# Altium schematic sheet Power_Management.SchDoc
size A4; SheetNumber: 1; SheetTotal: 4
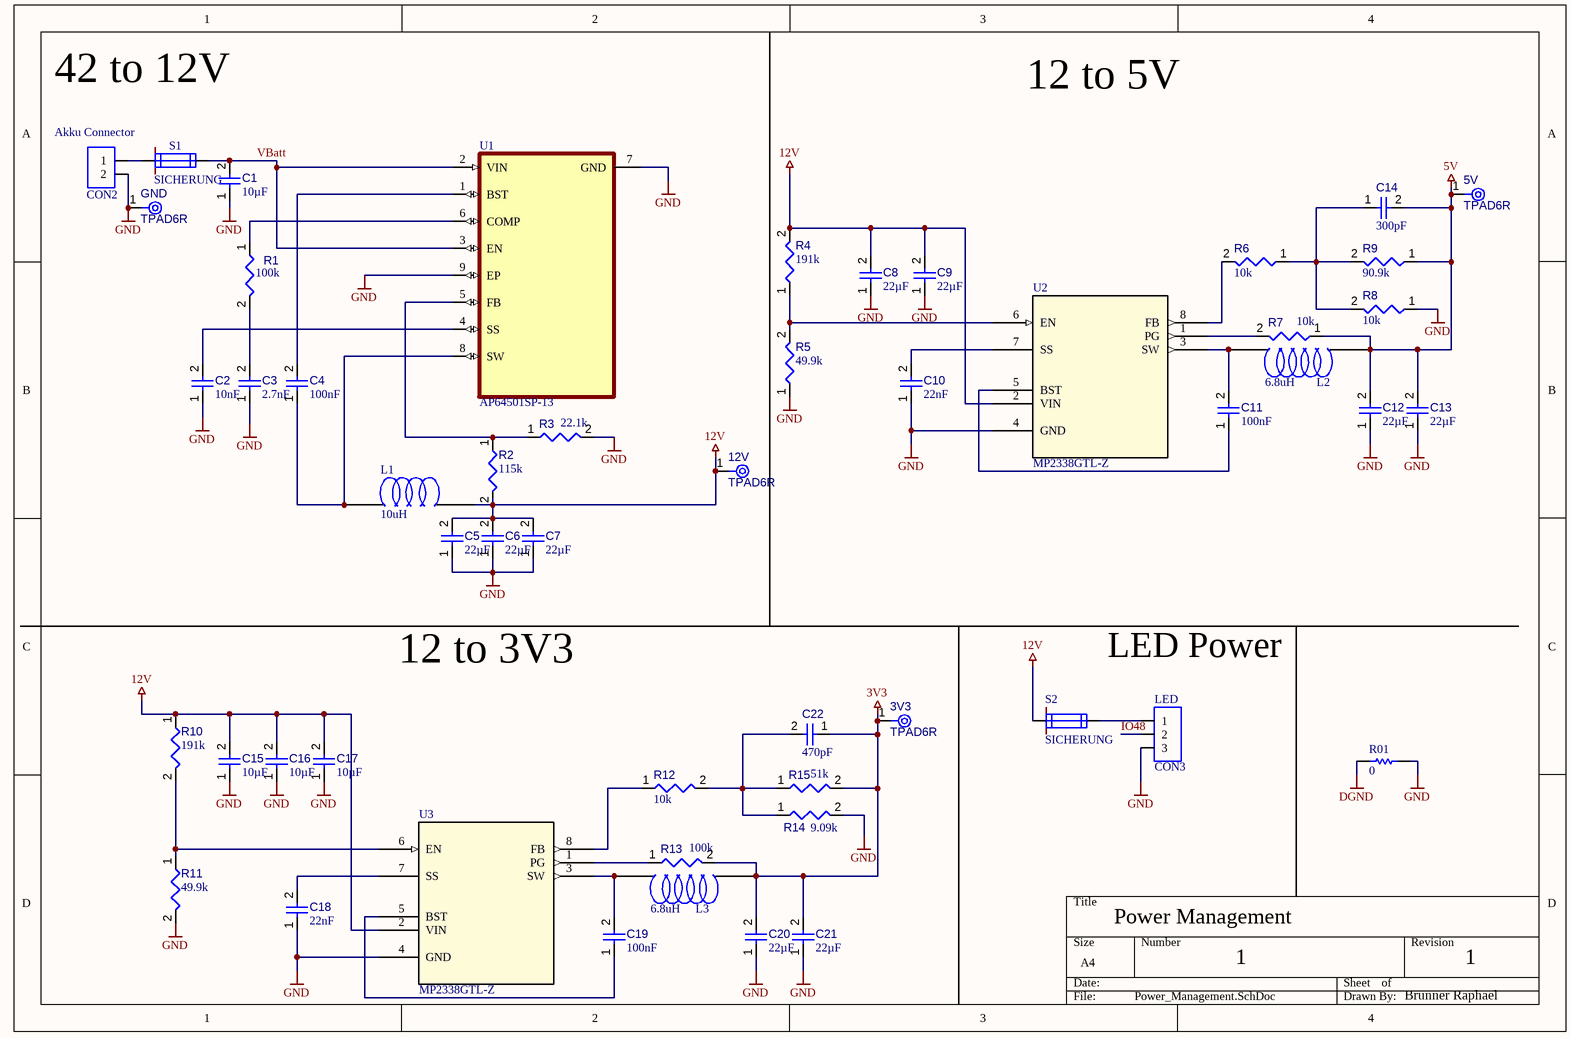
[diagram p0: Power_Management.SchDoc]

## Parts
3V3  TPAD6R  [TP06R]  (no BOM)
5V  TPAD6R  [TP06R]  (no BOM)
12V  TPAD6R  [TP06R]  (no BOM)
Akku_Connector  CON2  [SIP-2]
C1  value 10µF  [CAPC0603(1608)100_L]  (hidden comment: Capacitor 10µF +/-20% 10V 0603)
C2  10nF  [CAPC1608X94X35NL15T15]
C3  2.7nF  [CAPC1608X94X35NL15T15]
C4  value 100nF  [CAPC1608X94X35NL15T15]  (hidden comment: 0.1uF)
C5  value 22µF  [CAPC0805(2012)145_L]  (hidden comment: Capacitor 22µF +/-40% 16V 0805)
C6  value 22µF  [CAPC0805(2012)145_L]  (hidden comment: Capacitor 22µF +/-40% 16V 0805)
C7  value 22µF  [CAPC0805(2012)145_L]  (hidden comment: Capacitor 22µF +/-40% 16V 0805)
C8  value 22µF  [CAPC0805(2012)145_L]  (hidden comment: Capacitor 22µF +/-40% 16V 0805)
C9  value 22µF  [CAPC0805(2012)145_L]  (hidden comment: Capacitor 22µF +/-40% 16V 0805)
C10  value 22nF  [CAPC0402(1005)60_L]  (hidden comment: Capacitor 22nF +/-20% 10V 0402)
C11  value 100nF  [CAPC1608X90X40NL10T20]  (hidden comment: Capacitor 100 nF +/-10% 50 V 0603)
C12  value 22µF  [CAPC0805(2012)145_L]  (hidden comment: Capacitor 22µF +/-40% 16V 0805)
C13  value 22µF  [CAPC0805(2012)145_L]  (hidden comment: Capacitor 22µF +/-40% 16V 0805)
C14  value 300pF  [CAPC1608X90X40NL10T20]  (hidden comment: Capacitor 100 nF +/-10% 50 V 0603)
C15  value 10µF  [CAPC0603(1608)100_L]  (hidden comment: Capacitor 10µF +/-20% 10V 0603)
C16  value 10µF  [CAPC0603(1608)100_L]  (hidden comment: Capacitor 10µF +/-20% 10V 0603)
C17  value 10µF  [CAPC0603(1608)100_L]  (hidden comment: Capacitor 10µF +/-20% 10V 0603)
C18  value 22nF  [CAPC1608X90X40NL10T20]  (hidden comment: Capacitor 100 nF +/-10% 50 V 0603)
C19  value 100nF  [CAPC1608X90X40NL10T20]  (hidden comment: Capacitor 100 nF +/-10% 50 V 0603)
C20  value 22µF  [CAPC0805(2012)145_L]  (hidden comment: Capacitor 22µF +/-40% 16V 0805)
C21  value 22µF  [CAPC0805(2012)145_L]  (hidden comment: Capacitor 22µF +/-40% 16V 0805)
C22  value 470pF  [CAPC1608X90X40NL10T20]  (hidden comment: Capacitor 100 nF +/-10% 50 V 0603)
GND  TPAD6R  [TP06R]  (no BOM)
L1  10uH  [MPL-AY1050]
L2  6.8uH  [MPL-AL6060]
L3  6.8uH  [MPL-AL6060]
LED  CON3  [Sip-3]
R1  value 100k  [RESC1608X55X25ML10T15]  (hidden comment: 34.7k)
R01  value 0  [RESC1608X55X25ML10T15]  (hidden comment: Resistor 0R +/- 5% 0603 100 mW)
R2  115k  [RESC1608X55X25ML10T15]
R3  value 22.1k  [RESC1608X55X25ML10T15]  (hidden comment: 115k)
R4  value 191k  [RESC1608X55X25ML10T15]  (hidden comment: Resistor 100k +/-1% 0603 100 mW)
R5  value 49.9k  [RESC1608X55X25ML10T15]  (hidden comment: Resistor 100k +/-1% 0603 100 mW)
R6  value 10k  [RESC1608X55X25ML10T15]  (hidden comment: Resistor 100k +/-1% 0603 100 mW)
R7  value 10k  [RESC1608X55X25ML10T15]  (hidden comment: Resistor 100k +/-1% 0603 100 mW)
R8  value 10k  [RESC1608X55X25ML10T15]  (hidden comment: Resistor 100k +/-1% 0603 100 mW)
R9  value 90.9k  [RESC1608X55X25ML10T15]  (hidden comment: Resistor 100k +/-1% 0603 100 mW)
R10  value 191k  [RESC1608X55X25ML10T15]  (hidden comment: Resistor 100k +/-1% 0603 100 mW)
R11  value 49.9k  [RESC1608X55X25ML10T15]  (hidden comment: Resistor 100k +/-1% 0603 100 mW)
R12  value 10k  [RESC1608X55X25ML10T15]  (hidden comment: Resistor 100k +/-1% 0603 100 mW)
R13  value 100k  [RESC1608X55X25ML10T15]  (hidden comment: Resistor 100k +/-1% 0603 100 mW)
R14  value 9.09k  [RESC1608X55X25ML10T15]  (hidden comment: Resistor 100k +/-1% 0603 100 mW)
R15  value 51k  [RESC1608X55X25ML10T15]  (hidden comment: Resistor 100k +/-1% 0603 100 mW)
S1  SICHERUNG  [SICHERUNG]
S2  SICHERUNG  [SICHERUNG]
U1  AP64501SP-13  [SOIC127P600X170-9N]
U2  MP2338GTL-Z  [SOT583_MP2338_MNP]
U3  MP2338GTL-Z  [SOT583_MP2338_MNP]

## Nets
3V3: 3V3.1(TP) C20.2 C21.2 C22.1 L3.2 R13.2 R15.2
5V: 5V.1(TP) C12.2 C13.2 C14.2 L2.2 R7.1 R9.1
12V: 12V.1(TP) C5.2 C6.2 C7.2 C8.2 C9.2 C15.2 C16.2 C17.2 L1.2 R2.2 R4.2 R10.1 S2.1 U2.2(VIN) U3.2(VIN)
DGND: R01.1
GND: Akku_Connector.2 C1.1 C2.1 C3.1 C5.1 C6.1 C7.1 C8.1 C9.1 C10.1 C12.1 C13.1 C15.1 C16.1 C17.1 C18.1 C20.1 C21.1 GND.1(TP) LED.3 R01.2 R3.2 R5.1 R8.1 R11.2 R14.2 U1.7(GND) U1.9(EP) U2.4(GND) U3.4(GND)
IO48: LED.2
VBatt: C1.2 S1.2 U1.2(VIN) U1.3(EN)
NetAkku_Connector_1: Akku_Connector.1 S1.1
NetC2_2: C2.2 U1.4(SS)
NetC3_2: C3.2 R1.2
NetC4_1: C4.1 L1.1 U1.8(SW)
NetC4_2: C4.2 U1.1(BST)
NetC10_2: C10.2 U2.7(SS)
NetC11_1: C11.1 U2.5(BST)
NetC11_2: C11.2 L2.1 U2.3(SW)
NetC14_1: C14.1 R6.1 R8.2 R9.2
NetC18_2: C18.2 U3.7(SS)
NetC19_1: C19.1 U3.5(BST)
NetC19_2: C19.2 L3.1 U3.3(SW)
NetC22_2: C22.2 R12.2 R14.1 R15.1
NetLED_1: LED.1 S2.2
NetR1_1: R1.1 U1.6(COMP)
NetR2_1: R2.1 R3.1 U1.5(FB)
NetR4_1: R4.1 R5.2 U2.6(EN)
NetR6_2: R6.2 U2.8(FB)
NetR7_2: R7.2 U2.1(PG)
NetR10_2: R10.2 R11.1 U3.6(EN)
NetR12_1: R12.1 U3.8(FB)
NetR13_1: R13.1 U3.1(PG)

## Notes on the sheet
- 42 to 12V
- 12 to 5V
- 12 to 3V3
- LED Power
- Power Management
- 1
- Brunner Raphael

## Library data of the parts
3V3 5V 12V GND = CMP-00028-00002-2: 0.6mm round; Pins: 1
Akku_Connector = CON2: Stecker
C1 C15-C17 = CMP-001-00075-4: Chip Capacitor, 10µF +/-20%, 10V, 0603, Thickness 1 mm; Tolerance: 10%; Voltage Rating: 10V; Max Operating Temperature: 85°C; Pins: 2; Case/Package: 0603; Mounting Technology: SMT; Min Operating Temperature: -55°C
C2-C4 = CMP-001-00003-6: Chip Capacitor, 1 uF, +/- 10%, 16 V, 0603 (1608 Metric); Voltage Rating: 16V; Capacitor Type: Ceramic; Max Operating Temperature: 125°C; Pins: 2; Tolerance: 10%; Min Operating Temperature: -55°C; RoHS Compliant: True; Mounting Technology: SM; Case/Package: 0603
  C2: Value: 10nF
  C3: Value: 2.7nF
C5-C9 C12 C13 C20 C21 = CMP-001-00081-4: Chip Capacitor, 22µF +/-40%, 16V, 0805, Thickness 1.45 mm; Tolerance: 5%; Voltage Rating: 16V; Mounting Technology: SMT; Pins: 2; Max Operating Temperature: 85°C; Case/Package: 0805; Min Operating Temperature: -55°C
C10 = CMP-001-00062-3: Chip Capacitor, 22nF +/-20%, 10V, 0402, Thickness 0.6 mm; Tolerance: 10%; Min Operating Temperature: -55°C; Case/Package: 0402; Pins: 2; Max Operating Temperature: 85°C; Mounting Technology: SMT; Voltage Rating: 10V
C11 C14 C18 C19 C22 = CMP-001-00017-6: Chip Capacitor, 100 nF, +/- 10%, 50 V, 0603 (1608 Metric); Voltage Rating: 50V; Capacitor Type: Ceramic; Tolerance: 10%; Mounting Technology: SM; Max Operating Temperature: 125°C; RoHS Compliant: True; Pins: 2; Case/Package: 0603; Min Operating Temperature: -55°C
L1-L3 = Component_1
LED = CON3: Stecker
R1-R15 = CMP-009-00023-5: Chip Resistor, 100 KOhm, +/- 1%, 0.1 W, -55 to 155 degC, 0603 (1608 Metric); Voltage Rating: 50V; Power: 100mW; Max Operating Temperature: 155°C; RoHS Compliant: True; Tolerance: 1%; Pins: 2; Case/Package: 0603; Mounting Technology: SM; Min Operating Temperature: -55°C
  R2: Value: 115k
R01 = CMP-009-00006-5: Chip Resistor, 0 Ohm, 0.1 W, -55 to 155 degC, 0603 (1608 Metric); Power: 100mW; Voltage Rating: 50V; Max Operating Temperature: 155°C; RoHS Compliant: True; Mounting Technology: SM; Case/Package: 0603; Min Operating Temperature: -55°C; Tolerance: 5%; Pins: 2
S1 S2 = SICHERUNG: Text Field1: Strom
U1 = AP64501SP-13: MF: {'manufacturer': u'Diodes Incorporated'}; Package: None; Price: None; Value: *; MP: AP64501SP-13; Availability: Unavailable
U2 U3 = MP2338GTL-Z: High-Efficiency 28V 3A 450kHz Synchronous Step-Down Converter In SOT583 Package; Manufacturer_Name: Monolithic Power Systems; Copyright: Copyright (C) 2025 Ultra Librarian. All rights reserved.; Manufacturer_Part_Number: MP2338GTL-Z; Datasheet: https://www.monolithicpower.com/en/documentview/productdocument/index/version/2/document_type/Datasheet/lang/en/sku/MP2338GTL; RefDes: RefDes; Type: Type